# EAGLE design sc (EAGLE 7.5.0)
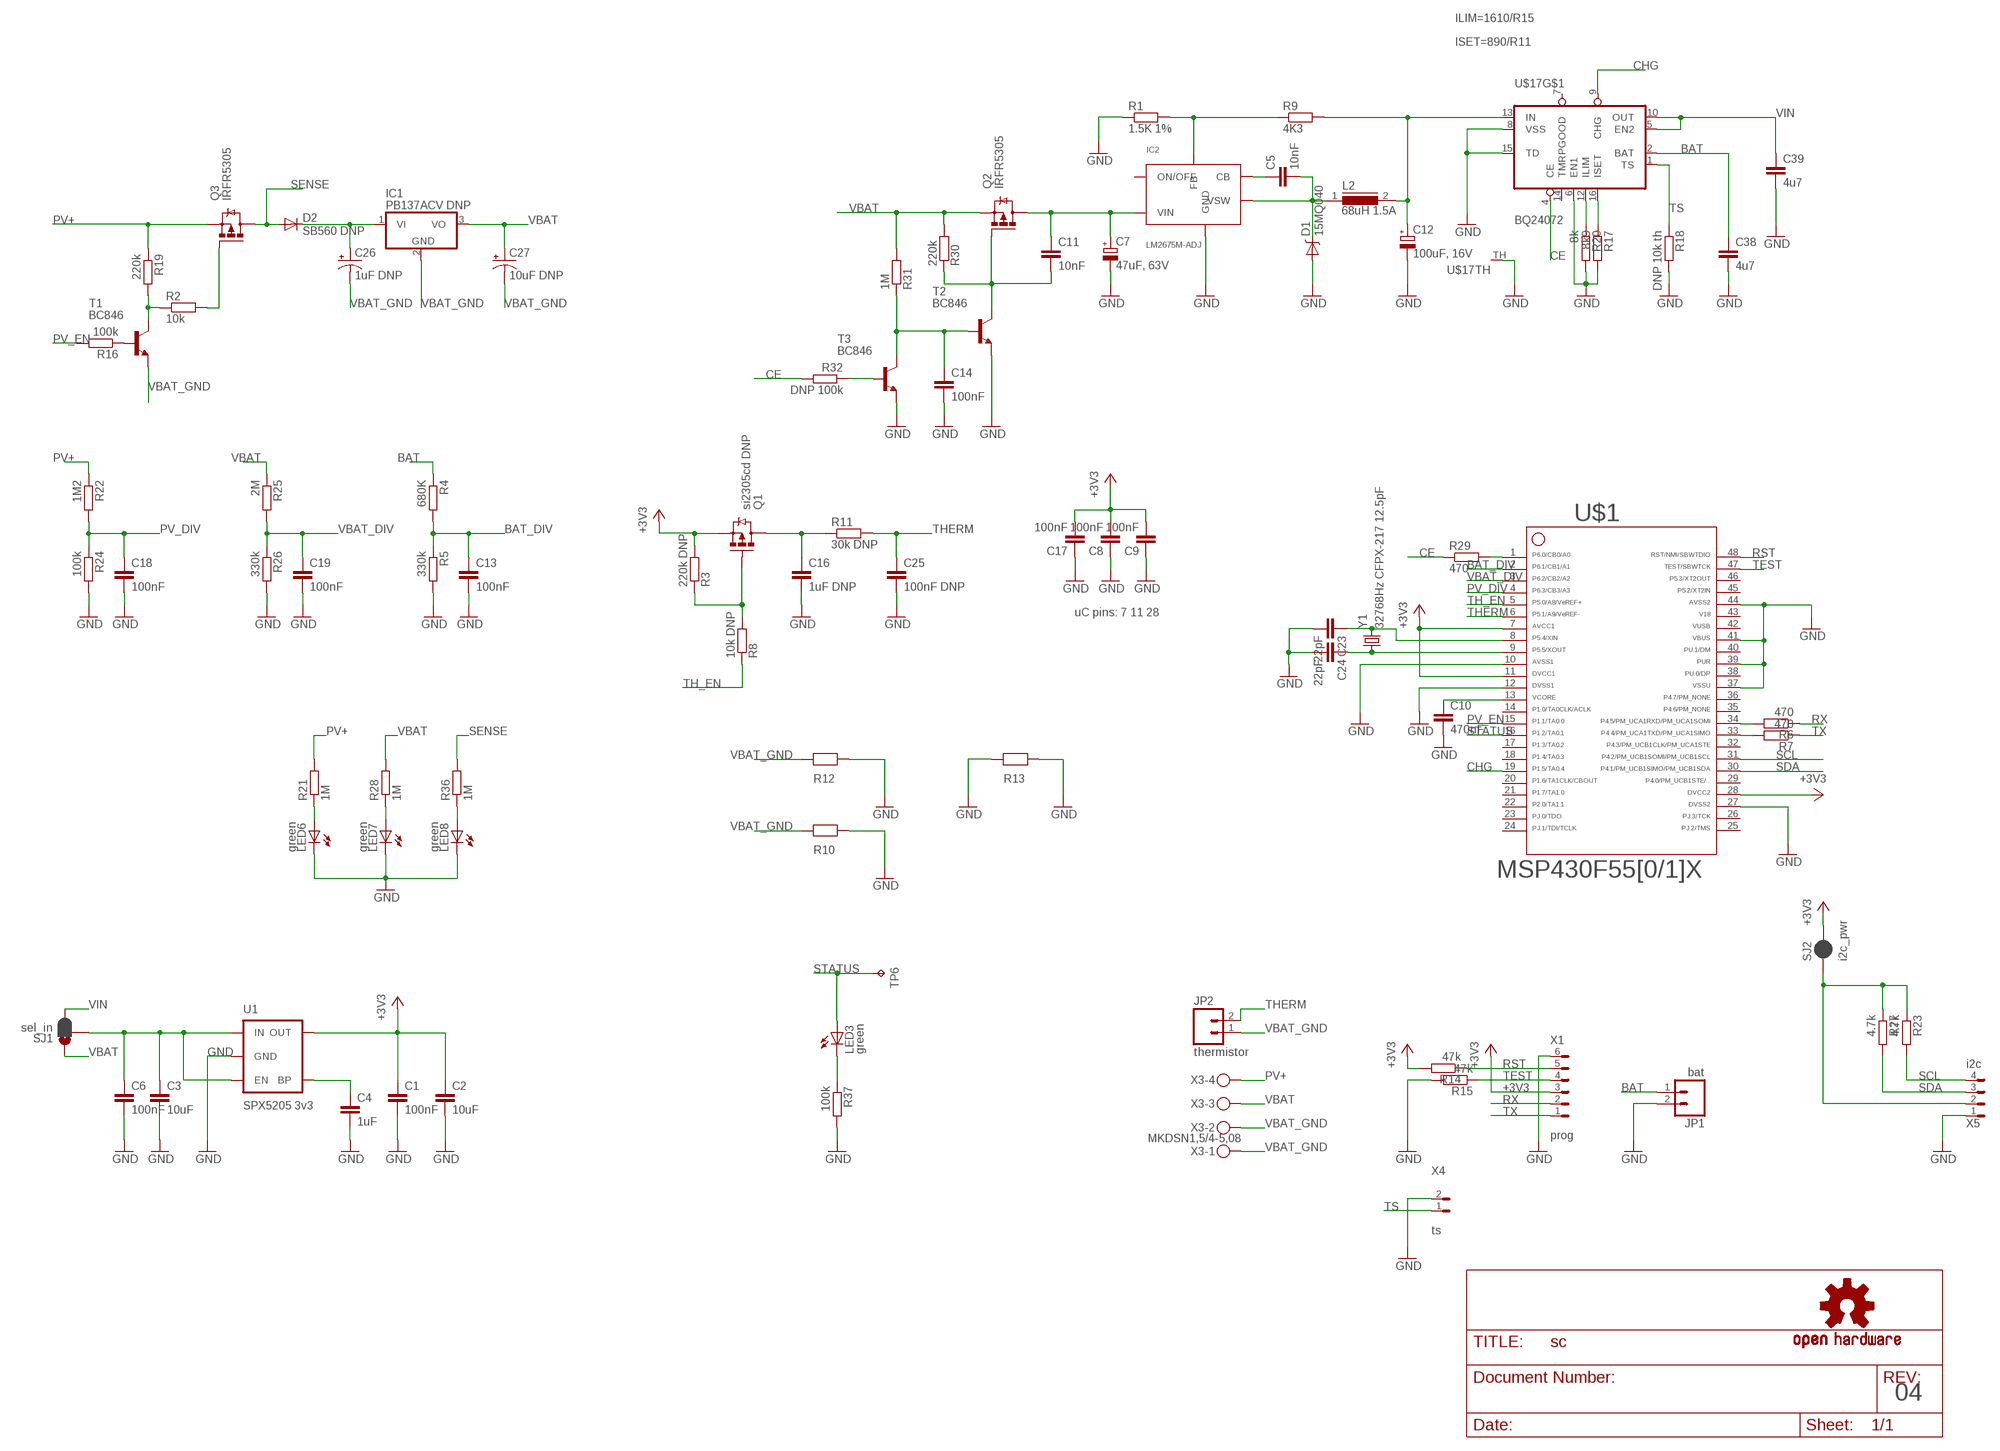
[diagram p0: schematic, sheet 1]

## Parts
C1  100nF  C-EUC0805  [C0805]
C2  10uF  C-EUC1206  [C1206]
C3  10uF  C-EUC1206  [C1206]
C4  1uF  C-EUC0805  [C0805]
C5  10nF  C-EUC0805  [C0805]
C6  100nF  C-EUC0805  [C0805]
C7  47uF, 63V  CPOL-EUF  [PANASONIC_F]
C8  100nF  C-EUC0805  [C0805]
C9  100nF  C-EUC0805  [C0805]
C10  470nF  C-EUC0805  [C0805]
C11  10nF  C-EUC0805  [C0805]
C12  100uF, 16V  CPOL-EUD  [PANASONIC_D]
C13  100nF  C-EUC0805  [C0805]
C14  100nF  C-EUC0805  [C0805]
C16  1uF DNP  C-EUC0805  [C0805]
C17  100nF  C-EUC0805  [C0805]
C18  100nF  C-EUC0805  [C0805]
C19  100nF  C-EUC0805  [C0805]
C23  22pF  C-EUC0805  [C0805]
C24  22pF  C-EUC0805  [C0805]
C25  100nF DNP  C-EUC0805  [C0805]
C26  1uF DNP  CAP_POLD  [PANASONIC_D]
C27  10uF DNP  CAP_POLD  [PANASONIC_D]
C38  4u7  C-EUC1206  [C1206]
C39  4u7  C-EUC1206  [C1206]
D1  15MQ040  DIODE-SCHOTTKY-MBRA140  [SMA-DIODE]
D2  SB560 DNP  DIODE-C1702-05  [C1702-05]
IC1  PB137ACV DNP  7812TV  [TO220V]
IC2  LM2675M-ADJ  LM2674  [SO-08]
JP1  bat  M02PTH  [1X02]
JP2  thermistor  M02PTH  [1X02]
L2  68uH 1.5A  DR125  [DR125]
LED3  green  LEDCHIPLED_0805  [CHIPLED_0805]
LED6  green  LEDCHIP-LED0805  [CHIP-LED0805]
LED7  green  LEDCHIP-LED0805  [CHIP-LED0805]
LED8  green  LEDCHIP-LED0805  [CHIP-LED0805]
Q1  si2305cd DNP  MOSFET-PCHANNELSMD_POWER  [SOT23-3_POWER@1]
Q2  IRFR5305  [D-PAK_TO252AA]
Q3  IRFR5305  [D-PAK_TO252AA]
R1  1.5K 1%  R-EU_R0805W  [R0805W]
R2  10k  R-EU_R0805W  [R0805W]
R3  220k DNP  R-EU_R0805W  [R0805W]
R4  680K  R-EU_R0805W  [R0805W]
R5  330k  R-EU_R0805W  [R0805W]
R6  470  R-EU_R0805W  [R0805W]
R7  470  R-EU_R0805W  [R0805W]
R8  10k DNP  R-EU_R0805W  [R0805W]
R9  4K3  R-EU_R0805W  [R0805W]
R10  0R_0805  [R0805W]
R11  30k DNP  R-EU_R0805W  [R0805W]
R12  0R_0805  [R0805W]
R13  0R_0805  [R0805W]
R14  47k  R-EU_R0805W  [R0805W]
R15  47k  R-EU_R0805W  [R0805W]
R16  100k  R-EU_R0805W  [R0805W]
R17  8k9  R-EU_R0805W  [R0805W]
R18  DNP 10k th  R-EU_R0805W  [R0805W]
R19  220k  R-EU_R0805W  [R0805W]
R20  8k  R-EU_R0805W  [R0805W]
R21  1M  R-EU_R0805W  [R0805W]
R22  1M2  R-EU_R0805W  [R0805W]
R23  4.7k  R-EU_R0805W  [R0805W]
R24  100k  R-EU_R0805W  [R0805W]
R25  2M  R-EU_R0805W  [R0805W]
R26  330k  R-EU_R0805W  [R0805W]
R27  4.7k  R-EU_R0805W  [R0805W]
R28  1M  R-EU_R0805W  [R0805W]
R29  470  R-EU_R0805W  [R0805W]
R30  220k  R-EU_R0805W  [R0805W]
R31  1M  R-EU_R0805W  [R0805W]
R32  DNP 100k  R-EU_R0805W  [R0805W]
R36  1M  R-EU_R0805W  [R0805W]
R37  100k  R-EU_R0805W  [R0805W]
SJ1  sel_in  JUMPER-PAD-3-2OF3_NC_BY_PASTE  [PAD-JUMPER-3-2OF3_NC_BY_PASTE_YES_SILK_FULL_BOX]
SJ2  i2c_pwr  JUMPER-PAD-2-NC_BY_PASTE  [PAD-JUMPER-2-NC_BY_PASTE_YES_SILK]
T1  BC846  [SOT23]
T2  BC846  [SOT23]
T3  BC846  [SOT23]
TP6  TPTP12R  [TP12R]
U1  SPX5205 3v3  V_REG_LDOSMD  [SOT23-5]
U$1  F55[0/1]X---PT48  [PT48]
U$7  OSHW-LOGOM  [OSHW-LOGO-M]
U$17  BQ24072  [S-PVQFN-N16]
X1  prog  MOLEX_6HORIZONTAL  [0530480610]
X3  MKDSN1,5/4-5,08  [MKDSN1,5/4-5,08]
X4  ts  MOLEX_2HORIZONTAL  [0530480210]
X5  i2c  MOLEX_4HORIZONTAL  [0530480401]
Y1  32768Hz CFPX-217 12.5pF  CRYSTAL3.2X1.5  [CRYSTAL-SMD-3.2X1.5]

## Nets
+3V3: C1.1 C2.1 C8.2 C9.2 C17.2 Q1.2(S) R3.2 R14.2 SJ2.2 U1.5(OUT) U$1.7 U$1.11 U$1.28 X1.3
BAT: C38.1 JP1.1 R4.1 U$17.2(BAT)
BAT_DIV: C13.1 R4.2 R5.1 U$1.2
CE: R29.1 R32.2 U$17.4(CE)
CHG: U$1.19 U$17.9(CHG)
GND: C1.2 C2.2 C3.2 C4.2 C6.2 C7.- C8.1 C9.1 C10.2 C12.- C13.2 C14.2 C16.2 C17.1 C18.2 C19.2 C23.2 C24.2 C25.2 C38.2 C39.2 D1.A IC2.6(GND) JP1.2 LED6.C LED7.C LED8.C R1.1 R5.2 R10.2 R12.2 R13.1 R13.2 R15.2 R17.2 R18.2 R20.2 R24.2 R26.2 R37.2 T2.2(E) T3.2(E) U1.2(GND) U$1.10 U$1.12 U$1.27 U$1.37 U$1.39 U$1.41 U$1.44 U$17.6(EN1) U$17.8(VSS) U$17.15(TD) U$17.TH(TH:TH) X1.6 X4.2 X5.1
N$1: C16.1 Q1.3(D) R11.1
N$2: C4.1 U1.4(BP)
N$3: R16.1 T1.1(B)
N$4: IC2.4(FB) R1.2 R9.1
N$5: R2.1 R19.2 T1.3(C)
N$6: C10.1 U$1.13
N$7: C3.1 C6.1 SJ1.2 U1.1(IN) U1.3(EN)
N$8: C26.+ D2.C IC1.1(VI)
N$9: C5.2 D1.C IC2.8(VSW) L2.1
N$10: C5.1 IC2.1(CB)
N$11: R6.2 U$1.34
N$12: LED6.A R21.1
N$13: R7.2 U$1.33
N$14: Q1.1(G) R3.1 R8.2
N$15: C12.+ L2.2 R9.2 U$17.13(IN)
N$16: C11.2 Q2.1(G) R30.1 T2.3(C)
N$17: R23.1 R27.1 SJ2.1 X5.2
N$18: LED7.A R28.1
N$20: R29.2 U$1.1
N$22: C14.1 R31.1 T2.1(B) T3.3(C)
N$23: R32.1 T3.1(B)
N$24: LED8.A R36.1
N$25: C24.1 U$1.9 Y1.P$1
N$26: C23.1 U$1.8 Y1.P$2
N$28: Q3.1(G) R2.2
N$29: R17.1 U$17.16(ISET)
N$33: R20.1 U$17.12(ILIM)
N$38: LED3.C R37.1
N$49: C7.+ C11.1 IC2.7(VIN) Q2.4(D)
PV+: Q3.3(S) R19.1 R21.2 R22.1 X3.4
PV_DIV: C18.1 R22.2 R24.1 U$1.4
PV_EN: R16.2 U$1.15
RST: R14.1 U$1.48 X1.5
RX: R6.1 X1.2
SCL: R23.2 U$1.31 X5.4
SDA: R27.2 U$1.30 X5.3
SENSE: D2.A Q3.4(D) R36.2
STATUS: LED3.A TP6.TP U$1.16
TEST: R15.1 U$1.47 X1.4
TH_EN: R8.1 U$1.5
THERM: C25.1 JP2.2 R11.2 U$1.6
TS: R18.1 U$17.1(TS) X4.1
TX: R7.1 X1.1
VBAT: C27.+ IC1.3(VO) Q2.3(S) R25.1 R28.2 R30.2 R31.2 SJ1.1 X3.3
VBAT_DIV: C19.1 R25.2 R26.1 U$1.3
VBAT_GND: C26.- C27.- IC1.2(GND) JP2.1 R10.1 R12.1 T1.2(E) X3.1 X3.2
VIN: C39.1 SJ1.3 U$17.5(EN2) U$17.10(OUT)
Unconnected: IC2.5(ON/OFF) U$1.14 U$1.17 U$1.18 U$1.20 U$1.21 U$1.22 U$1.23 U$1.24 U$1.25 U$1.26 U$1.29 U$1.32 U$1.35 U$1.36 U$1.38 U$1.40 U$1.45 U$17.7(PGOOD) U$17.14(TMR)

## Notes on the sheet
- ILIM=1610/R15
- ISET=890/R11
- uC pins: 7 11 28
- 04

## Power pins joined to a net without a drawn wire
42: U$1.42
43: U$1.43
46: U$1.46

## Library data of the parts
C1-C6 C8-C11 C13 C14 C16-C19 C23-C25 C38 C39 = rcl:C-EU: CAPACITOR, European symbol
C7 C12 = rcl:CPOL-EU: POLARIZED CAPACITOR, European symbol
C26 C27 = SparkFun-Capacitors:CAP_POL: Capacitor Polarized These are standard SMD and PTH capacitors. Normally 10uF, 47uF, and 100uF in electrolytic and tantalum varieties. Always verify the external diameter of the through hole cap, it varies with capacity, voltage, and manufacturer. The EIA devices should be standard.
D1 = SparkFun-DiscreteSemi:DIODE-SCHOTTKY: Schottky diodes in SFE's production catalog BAT20J 1A 23V 0.62Vf RB751 120mA 40V 0.37Vf PMEG4005EJ 0.5A 40V 0.42Vf MBRA140 1A 40V 0.5Vf B340A 3A 40V SMA; PROD_ID: DIO-08053; VALUE: MBRA140
D2 = diode:DIODE-: DIODE
IC1 = linear:78*: Positive VOLTAGE REGULATOR Source: http://cache.national.com/ds/LM/LM78L05.pdf http://www.fairchildsemi.com/ds/LM/LM7805.pdf
IC2 = Simplex-ICs:LM2674: LM2674 power converter
JP1 JP2 = SparkFun-Connectors:M02: Header 2 Standard 2-pin 0.1" header. Use with straight break away headers (SKU : PRT-00116), right angle break away headers (PRT-00553), swiss pins (PRT-00743), machine pins (PRT-00117), and female headers (PRT-00115). Molex polarized connector foot print use with SKU : PRT-08233 with associated crimp pins and housings.
L2 = inductors:DR125: High Power Density, High Efficiency, Shielded Inductors Source: coiltronics_dr_series.pdf
LED3 LED6-LED8 = led:LED: LED OSRAM: - CHIPLED LG R971, LG N971, LY N971, LG Q971, LY Q971, LO R971, LY R971 LH N974, LH R974 LS Q976, LO Q976, LY Q976 LO Q996 - Hyper CHIPLED LW Q18S LB Q993, LB Q99A, LB R99A - SideLED LS A670, LO A670, LY A670, LG A670, LP A670 LB A673, LV A673, LT A673, LW A673 LH A674 LY A675 LS A676, LA A676, LO A676, LY A676, LW A676 LS A679, LY A679, LG A679 - Hyper Micro SIDELED® LS Y876, LA Y876, LO Y876, LY Y876 LT Y87S - SmartLED LW L88C, LW L88S LB L89C, LB L89S, LG L890 LS L89K, LO L89K, LY L89K LS L896, LA L896, LO L896, LY L896 - TOPLED LS T670, LO T670, LY T670, LG T670, LP T670 LSG T670, LSP T670, LSY T670, LOP T670, LYG T670 LG T671, LOG T671, LSG T671 LB T673, LV T673, LT T673, LW T673 LH T674 LS T676, LA T676, LO T676, LY T676, LB T676, LH T676, LSB T676, LW T676 LB T67C, LV T67C, LT T67C, LS T67K, LO T67K, LY T67K, LW E67C LS E67B, LA E67B, LO E67B, LY E67B, LB E67C, LV E67C, LT E67C LW T67C LS T679, LY T679, LG T679 LS T770, LO T770, LY T770, LG T770, LP T770 LB T773, LV T773, LT T773, LW T773 LH T774 LS E675, LA E675, LY E675, LS T675 LS T776, LA T776, LO T776, LY T776, LB T776 LHGB T686 LT T68C, LB T68C - Hyper Mini TOPLED® LB M676 - Mini TOPLED Santana® LG M470 LS M47K, LO M47K, LY M47K Source: http://www.osram.convergy.de LUXEON: - LUMILED® LXK2-PW12-R00, LXK2-PW12-S00, LXK2-PW14-U00, LXK2-PW14-V00 LXK2-PM12-R00, LXK2-PM12-S00, LXK2-PM14-U00 LXK2-PE12-Q00, LXK2-PE12-R00, LXK2-PE12-S00, LXK2-PE14-T00, LXK2-PE14-U00 LXK2-PB12-K00, LXK2-PB12-L00, LXK2-PB12-M00, LXK2-PB14-N00, LXK2-PB14-P00, LXK2-PB14-Q00 LXK2-PR12-L00, LXK2-PR12-M00, LXK2-PR14-Q00, LXK2-PR14-R00 LXK2-PD12-Q00, LXK2-PD12-R00, LXK2-PD12-S00 LXK2-PH12-R00, LXK2-PH12-S00 LXK2-PL12-P00, LXK2-PL12-Q00, LXK2-PL12-R00 Source: www.luxeon.com KINGBRIGHT: KA-3528ASYC Source: www.kingbright.com
Q1 = Simplex-DiscreteSemi:MOSFET-PCHANNEL: Generic PMOSFET
Q2 Q3 = transistor-power:IRF?5305: HEXFET Power MOSFET Source: http://www.irf.com/product-info/datasheets/data/irfr5305pbf.pdf
R1-R9 R11 R14-R32 R36 R37 = rcl:R-EU_: RESISTOR, European symbol
R10 R12 R13 = Simplex-Jumpers:0R
SJ1 = SparkFun-Passives:JUMPER-PAD-3-2OF3_NC_BY_PASTE
SJ2 = SparkFun-Passives:JUMPER-PAD-2-NC_BY_PASTE
T1-T3 = transistor:BC846: NPN TRANSISTOR
TP6 = testpad:TP: Test pad
U1 = SparkFun:V_REG_LDO: Voltage Regulator LDO Standard 150mA LDO voltage regulator in SOT-23 layout. Micrel part MIC5205. BP (by-pass) pin is used to lower output noise with 470pF cap.
U$1 = TI_MSP430_v16:F55[0/1]X---PT48: ***F55[0/1/2]X*** PT48 Rev. 1.0 06/2010 "http://www.ti.com/lit/gpn/msp430f5509" Only for FF5504, F5508,F5509,F5510
U$7 = SparkFun:OSHW-LOGO: Open Source Hardware Logo This logo indicates the piece of hardware it is found on incorporates a OSHW license and/or adheres to the definition of open source hardware found here: http://freedomdefined.org/OSHW
U$17 = Simplex-ICs:BQ24072: TI BQ24072 - Li battery charger and power path management ic
X1 = Simplex-Connectors:MOLEX_6: Molex 6 pin connectors 1.25mm PicoBlade
X3 = con-phoenix-508:MKDSN1,5/4-5,08: MKDSN 1,5/ 4-5,08 Printklemme Nennstrom: 13,5 A Nennspannung: 250 V Rastermaß: 5,08 mm Polzahl: 4 Anschlussart: Schraubanschluss Montage: Löten Anschlussrichtung Leiter/Platine: 0 ° Artikelnummer: 1729144 Source: http://eshop.phoenixcontact.com .. 1729144.pdf; MPN: SMKDSN1,5/4-5,08; OC_FARNELL: 1792905; OC_NEWARK: 70R0300
X4 = Simplex-Connectors:MOLEX_2: Molex 2 pin connectors 1.25mm PicoBlade
X5 = Simplex-Connectors:MOLEX_4: Molex 4 pin connectors 1.25mm PicoBlade
Y1 = Simplex-FreqCtrl:CRYSTAL: smd crystals

## Net classes
1 vcc: width 0.203 mm

## Board
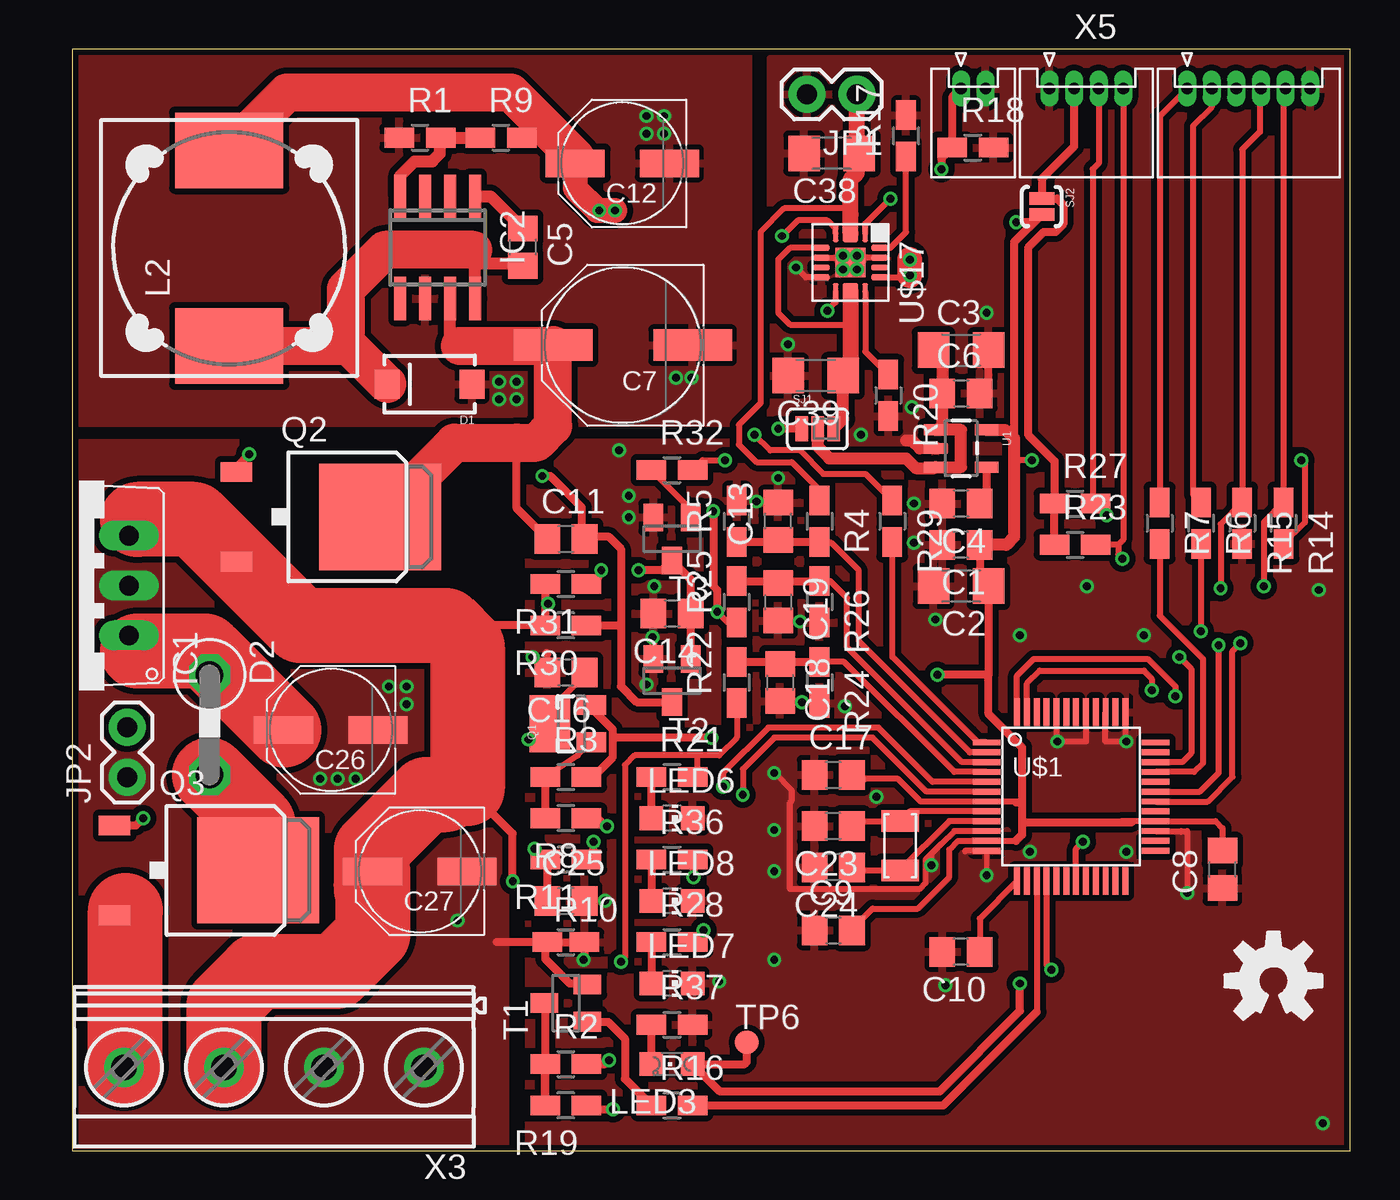
[diagram p1: board, top side]
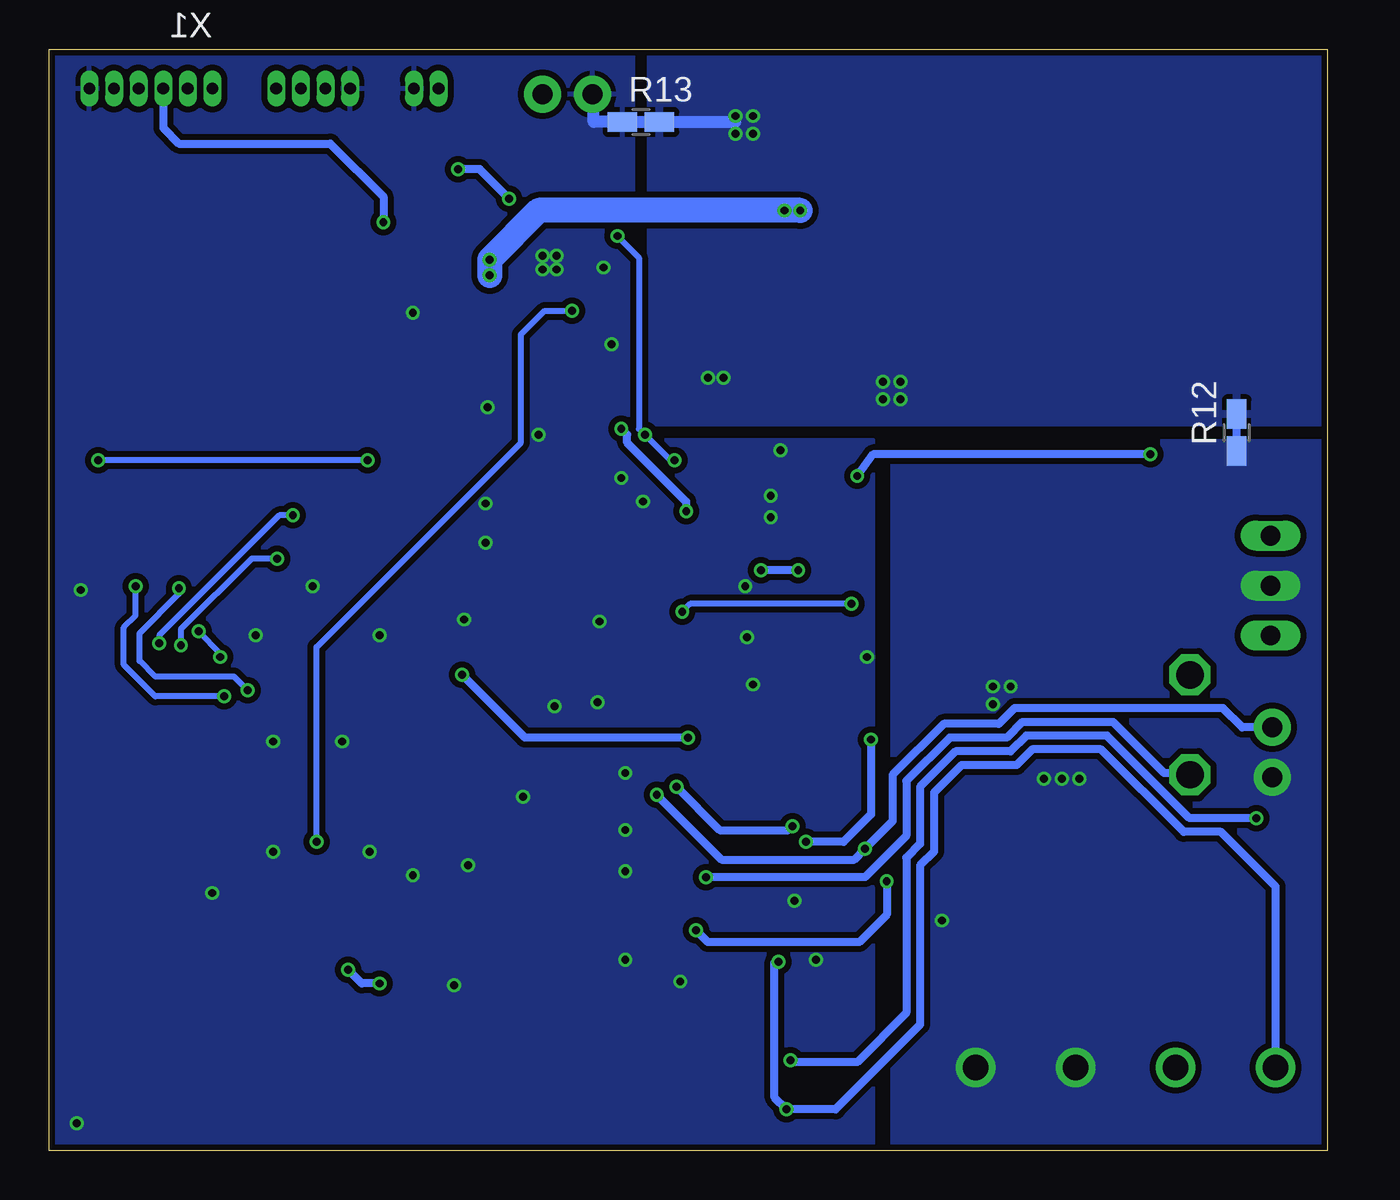
[diagram p2: board, bottom side, seen from below]

Size 65 x 56 mm. Coordinates in mm from the lower left corner, seen from the top.
Outline: 0,0 65,0 65,56 0,56 0,0
Copper layers (1*16): Top 0.035mm / dielectric 1.5mm / Bottom 0.035mm
Design rules "seeed_2-layer_20140221": minimum track width 6mil, minimum drill 12mil, track to track 6mil, track to pad 6mil, pad to pad 6mil, via to via 6mil, smd to smd 0mil, copper to edge 10mil, drill to drill 10mil, minimum pad ring 6mil, minimum via ring 6mil, stop-mask expansion 2mil, vias tented up to drill 100mil, thermal gap 10mil

### Footprints (pad centres in the part's own frame; a part is rotated, then mirrored left to right if it is on the bottom)
C0805 = smd 1.3 x 1.5: 1 -0.95,0; 2 0.95,0
C1206 = smd 1.6 x 1.8: 1 -1.4,0; 2 1.4,0
PANASONIC_F = smd 4 x 1.6: + 3.55,0; - -3.55,0
PANASONIC_D = smd 3 x 1.4: + 2.4,0; - -2.4,0
SMA-DIODE = smd 1.27 x 1.47: A -2.15,0; C 2.15,0
C1702-05 = drill 1.397 octagon: A 2.54,0; C -2.54,0
TO220V = drill 1.016 long: 1 -2.54,-2.54; 2 0,-2.54; 3 2.54,-2.54
SO-08 = smd 0.6 x 2.2: 1 -1.905,-2.6; 2 -0.635,-2.6; 3 0.635,-2.6; 4 1.905,-2.6; 5 1.905,2.6; 6 0.635,2.6; 7 -0.635,2.6; 8 -1.905,2.6
1X02 = drill 1.016 pad 1.88: 1 0,0; 2 2.54,0
DR125 = smd 3.85 x 5.5: 1 -4.975,0; 2 4.975,0
CHIPLED_0805 = smd 1.2 x 1.2: A 0,-1.05; C 0,1.05
CHIP-LED0805 = smd 1.2 x 1.2: A 0,-1.05; C 0,1.05
SOT23-3_POWER@1 = smd 1 x 1.5: 1 -0.939,-1.384; 2 0.961,-1.384 | smd 2.9 x 2.05: 3 0.011,0.716
D-PAK_TO252AA = smd 1 x 1.6: 1 -2.28,-4.8; 3 2.28,-4.8 | smd 5.4 x 6.2: 4 0,2.5
R0805W = smd 1.5 x 1: 1 -1.052,0; 2 1.052,0
R0805W' = smd 1.5 x 1: 1 -0.94,0; 2 0.94,0
PAD-JUMPER-3-2OF3_NC_BY_PASTE_YES_SILK_FULL_BOX = smd 0.635 x 1.27: 1 -0.813,0; 2 0,0; 3 0.813,0
PAD-JUMPER-2-NC_BY_PASTE_YES_SILK = smd 0.635 x 1.27: 1 -0.401,0; 2 0.413,0
SOT23 = smd 1 x 1.4: 1 -0.95,-1.1; 2 0.95,-1.1; 3 0,1.1
TP12R = smd 1.2 x 1.2: TP 0,0
SOT23-5 = smd 0.55 x 1.2: 1 -0.95,-1.3; 2 0,-1.3; 3 0.95,-1.3; 4 0.95,1.3; 5 -0.95,1.3
PT48 = smd 1.4 x 0.3: 1 -4.3,2.75; 2 -4.3,2.25; 3 -4.3,1.75; 4 -4.3,1.25; 5 -4.3,0.75; 6 -4.3,0.25; 7 -4.3,-0.25; 8 -4.3,-0.75; 9 -4.3,-1.25; 10 -4.3,-1.75; 11 -4.3,-2.25; 12 -4.3,-2.75; 25 4.3,-2.75; 26 4.3,-2.25; 27 4.3,-1.75; 28 4.3,-1.25; 29 4.3,-0.75; 30 4.3,-0.25; 31 4.3,0.25; 32 4.3,0.75; 33 4.3,1.25; 34 4.3,1.75; 35 4.3,2.25; 36 4.3,2.75 | smd 0.3 x 1.4: 13 -2.75,-4.3; 14 -2.25,-4.3; 15 -1.75,-4.3; 16 -1.25,-4.3; 17 -0.75,-4.3; 18 -0.25,-4.3; 19 0.25,-4.3; 20 0.75,-4.3; 21 1.25,-4.3; 22 1.75,-4.3; 23 2.25,-4.3; 24 2.75,-4.3; 37 2.75,4.3; 38 2.25,4.3; 39 1.75,4.3; 40 1.25,4.3; 41 0.75,4.3; 42 0.25,4.3; 43 -0.25,4.3; 44 -0.75,4.3; 45 -1.25,4.3; 46 -1.75,4.3; 47 -2.25,4.3; 48 -2.75,4.3
S-PVQFN-N16 = smd 0.85 x 0.28: 1 -0.725,2.225; 4 -0.725,0.725; 9 2.225,0.725; 12 2.225,2.225 | smd 0.85 x 0.78: 2 -0.725,1.475; 10 2.225,1.475 | smd 0.28 x 0.85: 5 0,0; 6 0.5,0; 7 1,0; 8 1.5,0; 13 1.5,2.95; 14 1,2.95; 15 0.5,2.95; 16 0,2.95 | smd 1.5 x 1.5: TH 0.75,1.475
0530480610 = drill 0.6 pad 0.9 long: 1 0,0; 2 1.25,0; 3 2.5,0; 4 3.75,0; 5 5,0; 6 6.25,0
MKDSN1,5/4-5,08 = drill 1.3 pad 2: 1 -7.641,0.025; 2 -2.561,0.025; 3 2.519,0.025; 4 7.599,0.025
0530480210 = drill 0.6 pad 0.9 long: 1 0,0; 2 1.25,0
0530480401 = drill 0.6 pad 0.9 long: 1 0,0; 2 1.25,0; 3 2.5,0; 4 3.75,0
CRYSTAL-SMD-3.2X1.5 = smd 1.1 x 1.9: P$1 -1.25,0; P$2 1.25,0

### Placement (x,y rotation side)
C1  45.2,30.8 180 top
C2  45.2,28.7 180 top
C3  45.2,40.7 0 top
C4  45.2,32.9 180 top
C5  22.9,45.94 270 top
C6  45.2,38.5 0 top
C7  28,40.95 180 top
C8  58.5,14.3 90 top
C9  38.7,11.2 0 top
C10  45.2,10.1 180 top
C11  25.1,31.1 0 top
C12  27.97,50.19 180 top
C13  35.9,32 90 top
C14  30.5,27.3 180 top
C16  25.1,24.3 180 top
C17  38.7,19.1 0 top
C18  36,23.8 270 top
C19  35.9,27.9 270 top
C23  38.7,16.5 180 top
C24  38.7,14.4 180 top
C25  25.1,12.7 0 top
C26  13.16,21.39 180 top
C27  17.68,14.2 180 top
C38  38.62,50.7 180 top
C39  37.8,39.4 180 top
D1  18.17,38.97 180 top
D2  6.98,21.65 270 top
IC1  0.34,28.73 90 top
IC2  18.58,45.92 180 top
JP1  39.9,53.7 180 top
JP2  2.79,18.98 90 top
L2  7.98,45.88 90 top
LED3  30.5,4.4 90 top
LED6  30.5,16.9 270 top
LED7  30.5,8.5 270 top
LED8  30.5,12.7 270 top
Q1  25,21.7 90 top
Q2  13.15,32.22 270 top
Q3  6.95,14.25 270 top
R1  17.68,51.5 0 top
R2  25.1,4.4 0 top
R3  25.1,19 0 top
R4  38,32 270 top
R5  33.8,32 90 top
R6  57.4,31.9 270 top
R7  55.3,31.9 270 top
R8  25.1,16.9 180 top
R9  21.8,51.5 0 top
R10  0R_0805  [R0805W']  25.1,10.6 0 top
R11  25.1,14.8 180 top
R12  0R_0805  [R0805W']  4.6,36.5 90 bottom
R13  0R_0805  [R0805W']  34.9,52.3 0 bottom
R14  61.6,31.9 270 top
R15  59.5,31.9 270 top
R16  30.5,2.3 0 top
R17  42.4,51.6 90 top
R18  45.8,51 0 top
R19  25.1,2.3 180 top
R20  41.5,38.4 270 top
R21  30.5,19 0 top
R22  33.8,23.8 90 top
R23  51,30.8 0 top
R24  38,23.8 270 top
R25  33.8,27.9 90 top
R26  38,27.9 270 top
R27  51,32.9 0 top
R28  30.5,10.6 0 top
R29  41.7,32 270 top
R30  25.1,26.7 180 top
R31  25.1,28.8 180 top
R32  30.5,34.6 0 top
R36  30.5,14.8 0 top
R37  30.5,6.4 0 top
SJ1  37.9,36.7 0 top
SJ2  49.3,48 270 top
T1  25.1,7.5 90 top
T2  30.5,23.9 180 top
T3  30.5,31.1 180 top
TP6  34.3,5.5 0 top
U1  45.2,35.7 270 top
U$1  50.8,18 0 top
U$7  61.09,8.63 0 top
U$17  38.1,45.9 270 top
X1  56.7,54 0 top
X3  10.23,4.25 180 top
X4  45.2,54 0 top
X5  49.7,54 0 top
Y1  42.1,15.5 90 top

### Tracks (layer width: path | path; a pad name or v marks a point on that pad's centre or on a via)
+3V3  (via drill 0.4)
  Top 0.305: U$1.11 45.75,15.75 | C9.2 39.65,11.25 40.7,12.3 43,12.3 44.6,13.9 44.6,15.3 45.05,15.75 U$1.11 | U$1.11 48,15.75 | 48,17.7 47.95,17.75 U$1.7 43.15,17.75 42,18.9 40.35,18.9 C17.2 39.7,19.65 | 53.4,16.7 arc-90 53.45,16.75 U$1.28 58.15,16.75 58.5,16.4 C8.2 | R14.2 62.7,31.95 62.7,35.1 v62.5,35.1 | v48.8,35.1 48.2,35.1 arc90 47.9,34.8
  Top 0.406: R3.2 26.5,19 27.5,20 27.5,21 | 27.5,21 27.5,21.4 26.38,22.52 Q1.2 | C1.1 46.15,29.15 C2.1 46.6,24.2 | 48.3,17.7 48.3,20.5 46.6,22.2 46.6,24.2 | 48.3,17.7 48.3,16.75 | 48.3,16.75 48.3,16.05 48,15.75 | 48,17.7 48.3,17.7 | 48.3,16.75 48.35,16.7 53.4,16.7 53.9,16.7 | 47.9,36 47.9,46.19 SJ2.2 48.91,47.2 v48,47.2 | v32.5,21 27.5,21 | 46.6,24.2 v44,24.2
  Top 0.61: U1.5 47.45,36.65 47.9,36.2 47.9,36 47.9,34.8 47.9,31.2 47.5,30.8 C1.1
  Bottom 0.305: v48.8,35.1 v62.5,35.1
  Bottom 0.406: X1.3 59.2,52 58.4,51.2 50.7,51.2 48,48.5 v48,47.2 | v32.5,21 40.8,21 v44,24.2
BAT
  Top 0.305: 39.58,47.6 39.27,47.9 36.2,47.9 35,46.7 35,38 33.9,36.9 33.9,35.9 34.8,35 36.6,35 38,33.6 R4.1
  Top 0.813: U$17.2 39.58,47.6 39.58,49.38 39.9,49.7 39.9,51 | 39.9,51 JP1.1 | C38.1 39.9,51
BAT_DIV
  Top 0.305: C13.1 35.9,30.95 R4.2 38.05,30.9 38.6,30.9 40,29.5 40,25.9 45.65,20.25 U$1.2
  Top 0.406: R5.1 R4.2
CE  (via drill 0.4)
  Top 0.305: U$17.4 38.83,46.88 38.4,47.3 36.9,47.3 v36.1,46.5 | R29.1 40.35,34.4 38.2,34.4 37,35.6 35.5,35.6 v34.7,36.4 | R32.2 32.05,35.1 v33.2,35.1
  Bottom 0.305: v36.1,46.5 35,45.4 35,36.7 v34.7,36.4 33.4,35.1 v33.2,35.1
CHG  (via drill 0.4)
  Top 0.305: U$17.9 38.83,43.12 v38.4,42.7 | U$1.19 51.05,15.35 v51.4,15.7
  Bottom 0.305: v51.4,15.7 51.4,25.6 41,36 41,41.5 39.8,42.7 v38.4,42.7
GND  (via drill 0.4)
  Top 0.254: 44.2,15.6 43.7,15.1 v43.7,14.5 | U$1.12 v46.5,14
  Top 0.305: U$17.15 39.83,45.4 arc90 U$17.TH | U$17.6 39.1,45.4 v39.2,45.5 | 56.4,16.2 56.4,16.25 U$1.27 56.7,16.25 v56.7,13.1 | U$1.12 45.45,15.25 arc90 45.4,15.2 | v35.7,19.2 36.6,18.3 36.6,17.8 36.5,17.7 36.5,13.3 43.1,13.3 43.4,13.6 43.4,14.8 44.2,15.6 44.85,16.25 U$1.10 | U$1.37 53.55,20.85 v53.6,20.8 52.55,20.8 U$1.39 | U$1.41 51.55,20.8 v50.1,20.8 50.05,20.8 U$1.44 | U$17.8 37.3,44.4 v36.8,44.9
  Top 0.406: 24.15,25.25 24.1,25.3 | C6.2 46.6,38.95 C3.2 | T2.2 29.55,26.05 v29.5,26.1 | v23.4,25.1 24.15,24.35 C16.2 | R10.2 26.04,9.74 v26,9.7
  Top 0.61: 44,35.7 U1.2 43.1,35.7 42.7,36.1 42.4,36.1
  Bottom 0.61: 37.3,53.7 37.3,52.3 R13.1 30.1,52.3 v30.1,52.6
  other vias: 22.6,39.1 21.7,39.1 21.7,38.2 30.1,51.7 29.2,51.7 29.2,52.6 22.6,38.2 39.9,45.5 39.9,44.8 39.2,44.8 30.7,39.3 31.5,39.3 36.4,41 40.1,36.4 42.7,37.8 63.4,28.5 28.3,32.2 63.6,1.4 44.4,8.4 39.3,22.6 35.7,9.7 35.7,16.3 35.7,14.2 29.6,28.7 32.9,8.6 27.1,12.7 53.6,15.2 48.7,15.2 42.8,32.9 42.8,30.9 43.9,27 46.5,42.6 48.2,26.2 51.6,28.7 54.5,26.2 37,26.9 29.2,23.7 34.8,33 27.8,35.6 35.9,34.2 28.3,33.3 37.1,22.8 40.9,18
  pour Top (isolate 0.305): 35.5,55.5 35.5,36 23.2,36 23.2,0 65,0 65,56
  pour Top (isolate 0.305): 0,56 0,37 34.4,37 34.4,56
  pour Bottom (isolate 0.305): 0,56 0,37 34.4,37 34.4,56
  pour Bottom (isolate 0.305): 35.3,55.9 65,56 65,0 23.1,0 23.1,36.1 35.3,36.1
N$1  (via drill 0.4)
  Top 0.3: Q1.3 24.28,22.38 25.6,23.7 25.6,23.85 C16.1
  Top 0.406: Q1.3 23.47,20.9 v23.2,20.9 | R11.1 26.5,15.15 v26.5,15.7
  Bottom 0.406: v23.2,20.9 23.2,17.1 24.6,15.7 v26.5,15.7
N$2
  Top 0.406: U1.4 46.5,33.25 C4.1
N$3
  Top 0.406: T1.1 27.25,6.55 28.1,5.7 28.1,3.65 R16.1
N$4
  Top 0.61: R9.1 R1.2 18.7,51.47 18.7,50.7 18.3,50.3 17.4,50.3 16.68,49.58 IC2.4
N$5
  Top 0.406: T1.3 24.05,7.45 R2.1 | R2.1 R19.2 24.1,2.35 24.1,2.5 24.05,2.55 R2.1
N$6
  Top 0.305: U$1.13 46.15,11.8 C10.1
N$7
  Top 0.61: C3.1 44.25,40.7 C6.1 44.25,36.65 U1.1 45.2,36.65 45.2,34.75 U1.3 43.85,34.7 42.9,34.7 42.4,35.2 38.5,35.2 37.9,35.8 SJ1.2
N$8
  Top 0.406: IC1.1 2.58,25.52 2.8,25.3 2.8,26.2 3.3,25.7 3.3,25.4 | D2.C 6.92,24.25 6.92,25.23
  Top 3.81: 3.3,25.4 6.75,25.4 6.92,25.23 C26.+
N$9
  Top 0.406: C5.2 arc90 22.79,45.1
  Top 0.61: IC2.8 20.48,45.1 | 20.48,45.1 20.48,45.8 20.4,45.8 | 22.79,45.1 20.48,45.1
  Top 1.93: D1.C 14.09,40.91 13.9,40.91 | 13.9,40.91 L2.1 | 20.4,45.8 15.9,45.8 13.9,43.8 13.9,40.91
N$10
  Top 0.61: IC2.1 21.27,48.52 C5.1
N$11  (via drill 0.4)
  Top 0.305: R6.2 v57.4,26.4 | v56.3,25.1 56.9,24.5 56.9,20.2 56.45,19.75 U$1.34
  Bottom 0.305: v57.4,26.4 56.3,25.3 v56.3,25.1
N$12
  Top 0.406: LED6.A R21.1
N$13
  Top 0.305: R7.2 55.3,27.2 57.5,25 57.5,19.7 57.05,19.25 U$1.33
N$14
  Top 0.3: R3.1 25.7,20.1 Q1.1
  Top 0.406: R3.1 R8.2
N$15  (via drill 0.4)
  Top 0.305: U$17.13 42.3,44.4 v42.6,44.5
  Top 0.406: R9.2 23.2,51.85 24.25,51.85
  Top 1.27: C12.+ 25.57,48.93 26.7,47.8 v26.8,47.8 v27.6,47.8 | v42.6,44.5 v42.6,45.3
  Top 1.93: L2.2 10.93,53.8 22.3,53.8 24.25,51.85 25.57,50.53 C12.+
  Bottom 1.27: v26.8,47.8 40.1,47.8 v42.6,45.3 | 42.6,45.1 v42.6,44.5
N$16  (via drill 0.4)
  Top 0.406: Q2.1 8.35,34.75 v9,35.4 | T2.3 28.7,22.8 27.9,23.6 27.9,26.7 | v23.9,34.3 24.3,34.3 25.9,32.7 25.9,31.25 C11.2 26.05,31.2 27.3,31.2 27.9,30.6 27.9,26.7 | R30.1 27.9,26.7
  Bottom 0.406: v9,35.4 23.1,35.4 v23.9,34.3
N$17
  Top 0.406: X5.2 50.95,51.05 49.3,49.4 SJ2.1 50.1,48.4 50.4,48.1 50.4,47.1 50,46.7 49.4,46.7 48.6,45.9 48.6,36.4 49.95,35.05 R27.1 R23.1
N$18
  Top 0.406: R28.1 LED7.A
N$20
  Top 0.305: U$1.1 46.05,20.75 41.7,25.1 R29.2
N$22  (via drill 0.4)
  Top 0.406: T2.1 C14.1 31.45,29.05 T3.3 30,29.5 v28.8,29.5 | R31.1 26.6,28.8 v26.9,29.5
  Bottom 0.406: v26.9,29.5 v28.8,29.5
N$23
  Top 0.305: R32.1 31.45,32.6 T3.1
N$24
  Top 0.406: R36.1 LED8.A
N$25
  Top 0.305: C24.1 39.8,14.25 Y1.P$1 44.6,16.75 U$1.9
N$26
  Top 0.305: C23.1 39.9,16.75 Y1.P$2 42.6,17.25 U$1.8
N$28  (via drill 0.4)
  Top 0.406: Q3.1 3.23,16.53 v3.6,16.9 | R2.2 27.1,4.4 v27.3,4.6
  Bottom 0.406: v27.3,4.6 27.2,4.5 23.9,4.5 21.4,7 21.4,14.9 20.7,15.6 20.7,18.5 18.9,20.3 16.1,20.3 15.3,21.1 11.2,21.1 7,16.9 v3.6,16.9
N$29
  Top 0.305: U$17.16 41.6,45.9 42.4,46.7 R17.1
N$33
  Top 0.305: U$17.12 40.33,40.63 R20.1
N$38
  Top 0.406: LED3.C R37.1
N$49
  Top 0.406: C11.1 22.6,32.65 22.6,36
  Top 0.61: 19.7,40.9 19.21,41.38 IC2.7
  Top 1.93: Q2.4 19.43,36 22.6,36 23.6,36 24.45,36.85 C7.+ 24.4,40.9 19.7,40.9
PV+  (via drill 0.4)
  Top 0.305: R22.1 33.8,21 32.9,20.1 31.7,20.1 | 31.7,20.1 28.6,20.1 28.1,19.6 28.1,9.8 v27.9,9.6 | 31.8,19.25 31.8,20 31.7,20.1
  Top 0.406: 2.7,12.2 2.67,12.17 Q3.3 | R19.1 26.35,2.1 v27.5,2.1 | 31.57,19.02 R21.2 31.8,19.25
  Top 3.81: X3.4 2.7,4.29 2.7,12.2
  Bottom 0.406: v27.9,9.6 28.1,9.6 28.1,2.7 v27.5,2.1 25,2.1 20.7,6.4 20.7,14.5 20,15.2 20,18.2 18.6,19.6 15.8,19.6 15,20.4 11.5,20.4 7.3,16.2 5.4,16.2 2.63,13.43 X3.4
PV_DIV
  Top 0.305: U$1.4 44.85,19.25 39.25,24.85 R24.1 36.1,24.85 C18.1
  Top 0.406: R22.2 R24.1
PV_EN
  Top 0.305: U$1.15 49.05,7.05
  Top 0.406: R16.2 44.3,2.3 49.05,7.05
RST  (via drill 0.4)
  Top 0.305: X1.5 61.6,53.9 R14.1 60.6,31.95 v60.6,28.7 | U$1.48 48.05,24.15 48.9,25 54.7,25 56.1,23.6 v56.1,23.1
  Bottom 0.305: v56.1,23.1 59.6,23.1 61.2,24.7 61.2,26.6 60.6,27.2 v60.6,28.7
RX
  Top 0.305: X1.2 57.95,53.05 57,52.1 57,33.35 R6.1
SCL  (via drill 0.4)
  Top 0.305: X5.4 53.45,31.05 53.2,30.8 | 53.2,30.8 R23.2 | U$1.31 57.35,18.25 58.3,19.2 v58.3,25.7 | 53.2,30.8 53.2,30.3 v53.4,30.1
  Bottom 0.305: v53.4,30.1 54.7,30.1 58.3,26.5 v58.3,25.7
SDA  (via drill 0.4)
  Top 0.305: X5.3 52.2,50.2 51.9,49.9 51.9,33.05 R27.2 52.6,32.35 v52.6,32.3 | U$1.30 57.75,17.75 59,19 59,25.4 v59.4,25.8
  Bottom 0.305: v52.6,32.3 53.3,32.3 59.4,26.2 v59.4,25.8
SENSE  (via drill 0.4)
  Top 0.406: R36.2 31.6,14.75 v31.6,13.9
  Top 3.81: Q3.4 9.45,16.64 D2.A
  Bottom 0.406: D2.A 7.07,19.2 8.3,19.2 10.9,21.8 15.5,21.8 16.3,21 19.2,21 21.4,18.8 21.4,16 23.5,13.9 v31.6,13.9
STATUS  (via drill 0.4)
  Top 0.305: U$1.16 49.55,9.45 v49.8,9.2
  Top 0.406: TP6.TP 34.3,4.5 34.2,4.4 LED3.A 32.95,3 44.1,3 48.2,7.1 v48.2,8.5
  Bottom 0.406: v48.2,8.5 49.1,8.5 v49.8,9.2
TEST  (via drill 0.4)
  Top 0.305: X1.4 60.4,53.95 60.4,51.8 59.5,50.9 R15.1 58.4,31.85 v58.4,28.6 | U$1.47 48.55,23.75 49.2,24.4 54.5,24.4 54.9,24 v54.9,23.4
  Bottom 0.305: v54.9,23.4 55.6,24.1 59.6,24.1 60.4,24.9 60.4,26.3 58.4,28.3 v58.4,28.6
TH_EN  (via drill 0.4)
  Top 0.305: R8.1 26.8,16.9 v27.2,16.5 | U$1.5 43.75,18.75 41,21.5 35.4,21.5 33.1,19.2 v33.1,18.5
  Bottom 0.406: v27.2,16.5 27.4,16.3 30.9,16.3 v33.1,18.5
THERM  (via drill 0.4)
  Top 0.305: U$1.6 43.45,18.25 40.7,21 35.7,21 34.1,19.4 v34.1,18.1 | R11.2 v23.5,15.35
  Top 0.406: 24.05,12.8 C25.1 24.15,14.8 R11.2 | v23.5,15.35 23.5,15.4
  Bottom 0.305: 23.95,14.9 v23.5,15.35
  Bottom 0.406: JP2.2 4.32,21.52 5.3,22.5 15.9,22.5 16.7,21.7 19.5,21.7 22.1,19.1 22.1,16.75 v23.5,15.35 R11.2 30.8,14.8 v34.1,18.1
TS  (via drill 0.4)
  Top 0.305: U$17.1 40.33,47.12 v41.6,48.4
  Top 0.406: X4.1 44.75,53.55 R18.1 44.2,50.45 v44.2,49.9
  Bottom 0.406: v41.6,48.4 43.1,49.9 v44.2,49.9
TX
  Top 0.305: X1.1 55.3,52.6 R7.1
VBAT  (via drill 0.4)
  Top 0.305: R25.1 33.35,26.85 v32.8,27.4
  Top 0.406: 3.3,32.1 2.58,31.88 IC1.3 | R28.2 31.55,10.65 v32.1,11.2 | SJ1.1 v35.9,36.7 | 19.4,17.7 19,18.1 | v22.4,13.7 22.4,16.12 20.1,18.42 | R31.2 24.05,27.8 | 24.05,27.8 R30.2 21.1,26.7 21.1,26.4 20.3,25.6 20.1,25.6 | v24.2,27.8 24.05,27.8 | v32.6,32.5 32.6,28.7 32.8,28.5 v32.8,27.4
  Top 3.81: 3.3,32.1 6.19,32.1 Q2.3 11.59,26.7 19,26.7 20.1,25.6 20.1,18.42 19.32,18.42 19,18.1 18,18.1 15.2,15.3 15.2,13.28 C27.+ 15.28,10.98 13.4,9.1 9.4,9.1 7.7,7.4 7.7,4.24 X3.3
  Bottom 0.305: v24.2,27.8 32.4,27.8 v32.8,27.4
  Bottom 0.406: v32.1,11.2 31.5,10.6 23.8,10.6 22.4,12 v22.4,13.7 | v35.9,36.7 35.6,36.4 35.6,36 32.6,33 v32.6,32.5
VBAT_DIV
  Top 0.305: U$1.3 45.25,19.75 39.4,25.6 39.4,28.1 38.55,28.95 R26.1
  Top 0.406: R25.2 R26.1 36,28.95 C19.1
VBAT_GND  (via drill 0.4)
  Top 0.406: T1.2 26.15,8.5 25.3,8.5 24.05,9.75 24.05,10.49 R10.1 21.6,10.6
  other vias: 17,23.6 17,22.7 14.4,18.9 13.5,18.9 16.1,23.6 12.6,18.9 19.6,11.7
  pour Top (isolate 0.305, no thermals): 0,36 22,36 22,0 0,0
  pour Bottom (isolate 0.305, no thermals): 0,36 0,0 22,0 22,36
VIN
  Top 0.305: U$17.5 36.5,45.9 35.9,45.3 35.9,42.6 36.5,42 39.58,42
  Top 0.61: SJ1.3 39.2,37.19 C39.1
  Top 0.813: U$17.10 39.58,42 39.58,39.4 C39.1

### Text on the board
tmine: +3v7 | ts | i2c | prog | pv | bat | gnd | gnd | sc rev04 Petre Rodan 201511 | github.com/rodan/solar-charger